# EAGLE board spartan6lx_board (EAGLE 5.11)
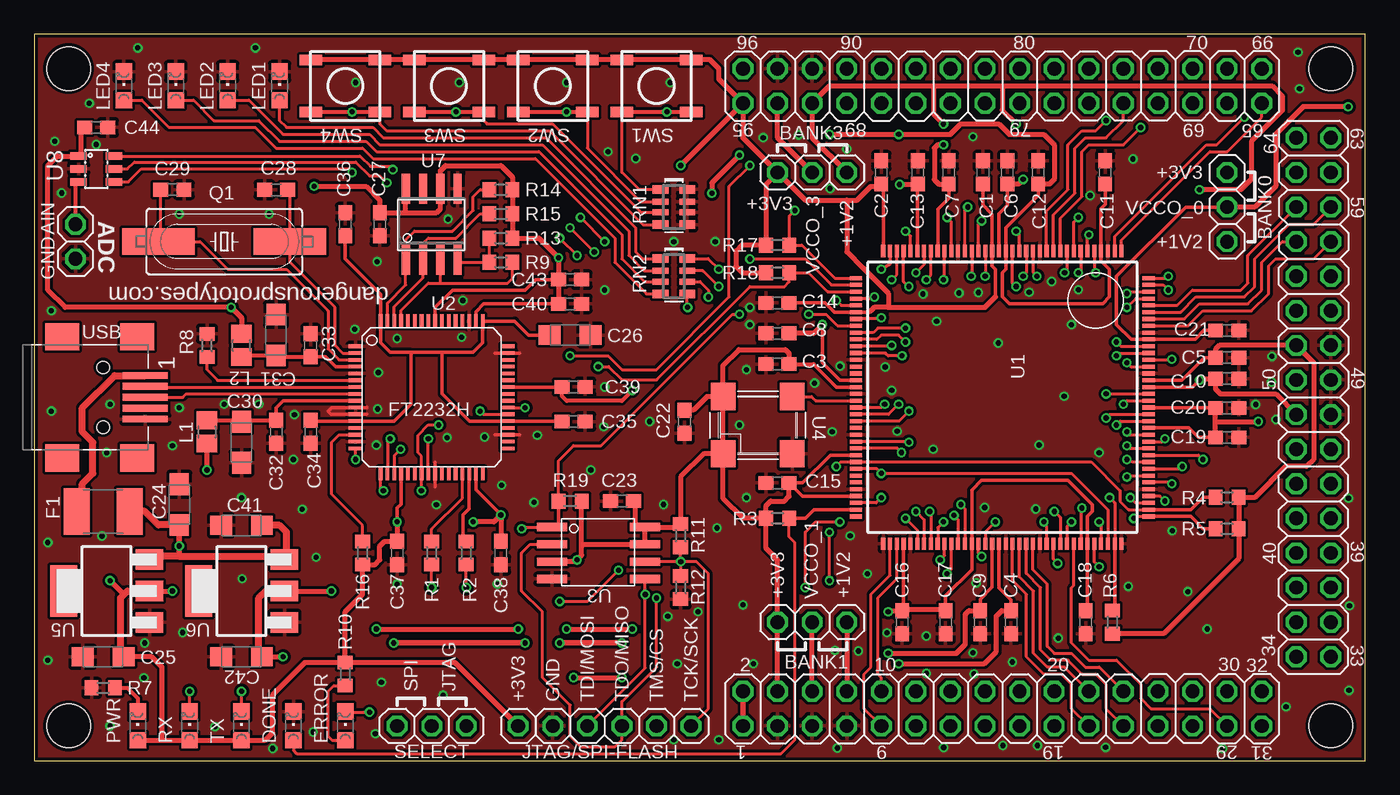
[diagram p2: board, top side]
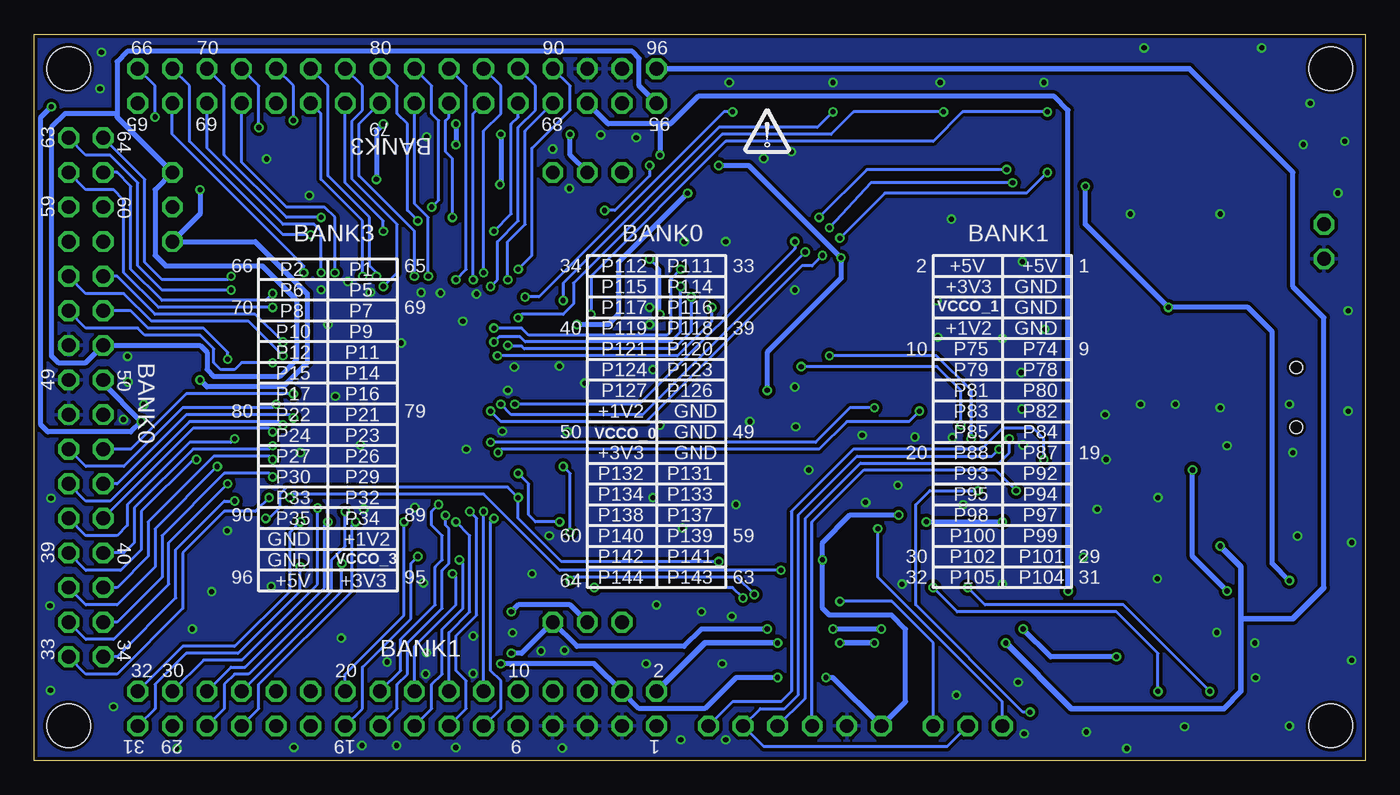
[diagram p3: board, bottom side, seen from below]

Size 97.79 x 53.34 mm. Coordinates in mm from the lower left corner, seen from the top.
Outline: 0,0 97.79,0 97.79,53.34 0,53.34 0,0
Copper layers (1*16): Top 0.035mm / dielectric 1.5mm / Bottom 0.035mm
Design rules "Fusion_eagle_rule_v1.1": minimum track width 6mil, minimum drill 12mil, track to track 6mil, track to pad 6mil, pad to pad 6mil, via to via 6mil, smd to smd 0mil, copper to edge 10mil, drill to drill 10mil, minimum pad ring 10mil, minimum via ring 6mil, stop-mask expansion 2mil, vias tented up to drill 100mil, thermal gap 10mil
Holes 3.2 mm at 2.54,2.54 2.54,50.8 95.25,50.8 95.25,2.54

## Footprints (pad centres in the part's own frame; a part is rotated, then mirrored left to right if it is on the bottom)
1X02 = drill 1.016 octagon: 1 -1.27,0; 2 1.27,0
2X16 = drill 1.016 octagon: 1 -19.05,-1.27; 2 -19.05,1.27; 3 -16.51,-1.27; 4 -16.51,1.27; 5 -13.97,-1.27; 6 -13.97,1.27; 7 -11.43,-1.27; 8 -11.43,1.27; 9 -8.89,-1.27; 10 -8.89,1.27; 11 -6.35,-1.27; 12 -6.35,1.27; 13 -3.81,-1.27; 14 -3.81,1.27; 15 -1.27,-1.27; 16 -1.27,1.27; 17 1.27,-1.27; 18 1.27,1.27; 19 3.81,-1.27; 20 3.81,1.27; 21 6.35,-1.27; 22 6.35,1.27; 23 8.89,-1.27; 24 8.89,1.27; 25 11.43,-1.27; 26 11.43,1.27; 27 13.97,-1.27; 28 13.97,1.27; 29 16.51,-1.27; 30 16.51,1.27; 31 19.05,-1.27; 32 19.05,1.27
C603 = smd 1.1 x 1: 1 -0.85,0; 2 0.85,0
SMC_A = smd 1.6 x 1.4: + -1.5,0; - 1.5,0
LED-805 = smd 1.2 x 1.2: A 0,-1.05; C 0,1.05
L1812 = smd 1.9 x 3.4: 1 -1.95,0; 2 1.95,0
1X06 = drill 1.016 octagon: 1 -6.35,0; 2 -3.81,0; 3 -1.27,0; 4 1.27,0; 5 3.81,0; 6 6.35,0
FB805 = smd 1.3 x 1.5: 1 -0.85,0; 2 0.85,0
HC-49U = smd 5.334 x 1.93: 1 -4.826,0; 2 4.826,0
R603 = smd 1 x 1.1: 1 -0.85,0; 2 0.85,0
RN8P-4R-CRA06S = smd 0.63 x 1.15: 1 -1.295,-0.975; 4 1.295,-0.975; 5 1.295,0.975; 8 -1.295,0.975 | smd 0.44 x 1.15: 2 -0.4,-0.975; 3 0.4,-0.975; 6 0.4,0.975; 7 -0.4,0.975
1X03 = drill 1.016 octagon: 1 -2.54,0; 2 0,0; 3 2.54,0
TACT_SWITCH_SMALL = smd 1.651 x 0.762: 1 -2.54,1.905; 2 2.54,1.905; 3 -2.54,-1.905; 4 2.54,-1.905
TQFP144 = smd 0.9 x 0.3: 1 -10.75,8.75; 2 -10.75,8.25; 3 -10.75,7.75; 4 -10.75,7.25; 5 -10.75,6.75; 6 -10.75,6.25; 7 -10.75,5.75; 8 -10.75,5.25; 9 -10.75,4.75; 10 -10.75,4.25; 11 -10.75,3.75; 12 -10.75,3.25; 13 -10.75,2.75; 14 -10.75,2.25; 15 -10.75,1.75; 16 -10.75,1.25; 17 -10.75,0.75; 18 -10.75,0.25; 19 -10.75,-0.25; 20 -10.75,-0.75; 21 -10.75,-1.25; 22 -10.75,-1.75; 23 -10.75,-2.25; 24 -10.75,-2.75; 25 -10.75,-3.25; 26 -10.75,-3.75; 27 -10.75,-4.25; 28 -10.75,-4.75; 29 -10.75,-5.25; 30 -10.75,-5.75; 31 -10.75,-6.25; 32 -10.75,-6.75; 33 -10.75,-7.25; 34 -10.75,-7.75; 35 -10.75,-8.25; 36 -10.75,-8.75; 73 10.75,-8.75; 74 10.75,-8.25; 75 10.75,-7.75; 76 10.75,-7.25; 77 10.75,-6.75; 78 10.75,-6.25; 79 10.75,-5.75; 80 10.75,-5.25; 81 10.75,-4.75; 82 10.75,-4.25; 83 10.75,-3.75; 84 10.75,-3.25; 85 10.75,-2.75; 86 10.75,-2.25; 87 10.75,-1.75; 88 10.75,-1.25; 89 10.75,-0.75; 90 10.75,-0.25; 91 10.75,0.25; 92 10.75,0.75; 93 10.75,1.25; 94 10.75,1.75; 95 10.75,2.25; 96 10.75,2.75; 97 10.75,3.25; 98 10.75,3.75; 99 10.75,4.25; 100 10.75,4.75; 101 10.75,5.25; 102 10.75,5.75; 103 10.75,6.25; 104 10.75,6.75; 105 10.75,7.25; 106 10.75,7.75; 107 10.75,8.25; 108 10.75,8.75 | smd 0.3 x 0.9: 37 -8.75,-10.75; 38 -8.25,-10.75; 39 -7.75,-10.75; 40 -7.25,-10.75; 41 -6.75,-10.75; 42 -6.25,-10.75; 43 -5.75,-10.75; 44 -5.25,-10.75; 45 -4.75,-10.75; 46 -4.25,-10.75; 47 -3.75,-10.75; 48 -3.25,-10.75; 49 -2.75,-10.75; 50 -2.25,-10.75; 51 -1.75,-10.75; 52 -1.25,-10.75; 53 -0.75,-10.75; 54 -0.25,-10.75; 55 0.25,-10.75; 56 0.75,-10.75; 57 1.25,-10.75; 58 1.75,-10.75; 59 2.25,-10.75; 60 2.75,-10.75; 61 3.25,-10.75; 62 3.75,-10.75; 63 4.25,-10.75; 64 4.75,-10.75; 65 5.25,-10.75; 66 5.75,-10.75; 67 6.25,-10.75; 68 6.75,-10.75; 69 7.25,-10.75; 70 7.75,-10.75; 71 8.25,-10.75; 72 8.75,-10.75; 109 8.75,10.75; 110 8.25,10.75; 111 7.75,10.75; 112 7.25,10.75; 113 6.75,10.75; 114 6.25,10.75; 115 5.75,10.75; 116 5.25,10.75; 117 4.75,10.75; 118 4.25,10.75; 119 3.75,10.75; 120 3.25,10.75; 121 2.75,10.75; 122 2.25,10.75; 123 1.75,10.75; 124 1.25,10.75; 125 0.75,10.75; 126 0.25,10.75; 127 -0.25,10.75; 128 -0.75,10.75; 129 -1.25,10.75; 130 -1.75,10.75; 131 -2.25,10.75; 132 -2.75,10.75; 133 -3.25,10.75; 134 -3.75,10.75; 135 -4.25,10.75; 136 -4.75,10.75; 137 -5.25,10.75; 138 -5.75,10.75; 139 -6.25,10.75; 140 -6.75,10.75; 141 -7.25,10.75; 142 -7.75,10.75; 143 -8.25,10.75; 144 -8.75,10.75
LQFP64 = smd 1 x 0.27: 1 -5.6,3.75; 2 -5.6,3.25; 3 -5.6,2.75; 4 -5.6,2.25; 5 -5.6,1.75; 6 -5.6,1.25; 7 -5.6,0.75; 8 -5.6,0.25; 9 -5.6,-0.25; 10 -5.6,-0.75; 11 -5.6,-1.25; 12 -5.6,-1.75; 13 -5.6,-2.25; 14 -5.6,-2.75; 15 -5.6,-3.25; 16 -5.6,-3.75; 33 5.6,-3.75; 34 5.6,-3.25; 35 5.6,-2.75; 36 5.6,-2.25; 37 5.6,-1.75; 38 5.6,-1.25; 39 5.6,-0.75; 40 5.6,-0.25; 41 5.6,0.25; 42 5.6,0.75; 43 5.6,1.25; 44 5.6,1.75; 45 5.6,2.25; 46 5.6,2.75; 47 5.6,3.25; 48 5.6,3.75 | smd 0.27 x 1: 17 -3.75,-5.6; 18 -3.25,-5.6; 19 -2.75,-5.6; 20 -2.25,-5.6; 21 -1.75,-5.6; 22 -1.25,-5.6; 23 -0.75,-5.6; 24 -0.25,-5.6; 25 0.25,-5.6; 26 0.75,-5.6; 27 1.25,-5.6; 28 1.75,-5.6; 29 2.25,-5.6; 30 2.75,-5.6; 31 3.25,-5.6; 32 3.75,-5.6; 49 3.75,5.6; 50 3.25,5.6; 51 2.75,5.6; 52 2.25,5.6; 53 1.75,5.6; 54 1.25,5.6; 55 0.75,5.6; 56 0.25,5.6; 57 -0.25,5.6; 58 -0.75,5.6; 59 -1.25,5.6; 60 -1.75,5.6; 61 -2.25,5.6; 62 -2.75,5.6; 63 -3.25,5.6; 64 -3.75,5.6
SOIC8W = smd 0.6 x 2.2: 1 -1.905,-3.87; 2 -0.635,-3.87; 3 0.635,-3.87; 4 1.905,-3.87; 5 1.905,2.981; 6 0.635,2.981; 7 -0.635,2.981; 8 -1.905,2.981
OSCILLATOR_7X5_SMD = smd 1.8 x 2: 1 -2.54,-2.1; 2 2.54,-2.1; 3 2.54,2.1; 4 -2.54,2.1
SOT223 = smd 1.5 x 2: 1 -2.3,-3.15; 2 0,-3.15; 3 2.3,-3.15 | smd 3.8 x 2: 4 0,3.15
SOIC8 = smd 0.6 x 2.2: 1 -1.905,-2.6; 2 -0.635,-2.6; 3 0.635,-2.6; 4 1.905,-2.6; 5 1.905,2.6; 6 0.635,2.6; 7 -0.635,2.6; 8 -1.905,2.6
SOT23-6 = smd 0.55 x 1.2: 1 -0.95,-1.3; 2 0,-1.3; 3 0.95,-1.3; 4 0.95,1.3; 5 0,1.3; 6 -0.95,1.3
CONN_USB_MINI-B = smd 2 x 2.5: BODY@1 -4.45,2.5; BODY@2 4.45,2.5; BODY@3 4.45,-3; BODY@4 -4.45,-3 | smd 0.5 x 3.3: D+ 0,3.1; D- -0.8,3.1; GND 1.6,3.1; ID 0.8,3.1; VUSB -1.6,3.1 | hole 0.9: -2.2,0; 2.2,0

## Placement (x,y rotation side)
ADC  [1X02]  3.05,38.1 270 top
BANK0  [2X16]  93.98,26.67 90 top
BANK1  [2X16]  71.12,3.81 0 top
BANK3  [2X16]  71.12,49.53 0 top
C1  0.1uF  [C603]  69.7,43.18 90 top
C2  0.1uF  [C603]  62.23,43.18 90 top
C3  0.1uF  [C603]  54.61,29.11 180 top
C4  0.1uF  [C603]  71.76,10.16 270 top
C5  0.1uF  [C603]  87.63,29.57 0 top
C6  0.1uF  [C603]  71.49,43.18 90 top
C7  0.1uF  [C603]  67.18,43.18 90 top
C8  0.1uF  [C603]  54.61,31.37 180 top
C9  0.1uF  [C603]  69.5,10.16 270 top
C10  0.1uF  [C603]  87.63,28.03 0 top
C11  0.1uF  [C603]  78.68,43.18 90 top
C12  0.1uF  [C603]  73.75,43.18 90 top
C13  0.1uF  [C603]  64.92,43.18 90 top
C14  0.1uF  [C603]  54.61,33.6 180 top
C15  0.1uF  [C603]  54.61,20.38 180 top
C16  0.1uF  [C603]  63.76,10.16 270 top
C17  0.1uF  [C603]  66.95,10.16 270 top
C18  0.1uF  [C603]  77.24,10.16 270 top
C19  0.1uF  [C603]  87.63,23.72 0 top
C20  0.1uF  [C603]  87.63,25.88 0 top
C21  0.1uF  [C603]  87.63,31.58 0 top
C22  0.1uF  [C603]  47.77,24.87 270 top
C23  0.1uF  [C603]  43.18,19.05 180 top
C24  4.7uF  [SMC_A]  10.67,18.8 90 top
C25  4.7uF  [SMC_A]  5.08,7.62 180 top
C26  3.3uF  [SMC_A]  39.37,31.24 0 top
C27  0.1uF  [C603]  25.4,39.37 270 top
C28  27pF  [C603]  17.78,41.91 180 top
C29  27pF  [C603]  10.16,41.91 0 top
C30  4.7uF  [SMC_A]  15.24,23.37 270 top
C31  4.7uF  [SMC_A]  17.78,31.24 90 top
C32  0.1uF  [C603]  17.78,24.13 270 top
C33  0.1uF  [C603]  20.32,30.48 90 top
C34  0.1uF  [C603]  20.32,24.13 270 top
C35  0.1uF  [C603]  39.62,24.89 0 top
C36  0.1uF  [C603]  22.86,39.37 90 top
C37  0.1uF  [C603]  26.67,15.24 270 top
C38  0.1uF  [C603]  34.29,15.24 270 top
C39  0.1uF  [C603]  39.62,27.43 0 top
C40  0.1uF  [C603]  39.37,33.53 0 top
C41  4.7uF  [SMC_A]  15.24,17.27 180 top
C42  4.7uF  [SMC_A]  15.24,7.62 180 top
C43  0.1uF  [C603]  39.37,35.31 0 top
C44  0.1uF  [C603]  4.57,46.48 0 top
DONE  [LED-805]  19.05,2.54 0 top
ERROR  [LED-805]  22.86,2.54 0 top
F1  500mA  [L1812]  5.08,18.29 180 top
JTAG/SPI-FLASH  [1X06]  41.91,2.54 0 top
L1  [FB805]  12.7,24.13 270 top
L2  [FB805]  15.24,30.48 90 top
LED1  [LED-805]  18.03,49.53 0 top
LED2  [LED-805]  14.22,49.53 0 top
LED3  [LED-805]  10.41,49.53 0 top
LED4  [LED-805]  6.6,49.53 0 top
PWR  [LED-805]  7.62,2.54 0 top
Q1  [HC-49U]  13.97,38.1 180 top
R1  470  [R603]  29.21,15.24 270 top
R2  470  [R603]  31.75,15.24 270 top
R3  330  [R603]  54.61,17.8 180 top
R4  4.7k  [R603]  87.63,19.32 0 top
R5  4.7k  [R603]  87.63,17.02 0 top
R6  4.7k  [R603]  79.2,10.16 270 top
R7  470  [R603]  5.08,5.33 0 top
R8  12k 1%  [R603]  12.7,30.48 270 top
R9  2.2k  [R603]  34.29,36.58 0 top
R10  330  [R603]  22.86,6.35 270 top
R11  100R  [R603]  47.5,16.51 90 top
R12  100R  [R603]  47.5,12.7 90 top
R13  10k  [R603]  34.29,38.35 0 top
R14  10k  [R603]  34.29,41.91 0 top
R15  10k  [R603]  34.29,40.13 0 top
R16  10k  [R603]  24.13,15.24 90 top
R17  4.7k  [R603]  54.61,37.85 0 top
R18  4.7k  [R603]  54.61,35.81 0 top
R19  4.7k  [R603]  39.37,19.05 0 top
RN1  4.7k  [RN8P-4R-CRA06S]  46.99,40.64 270 top
RN2  330  [RN8P-4R-CRA06S]  46.99,35.56 270 top
RX  [LED-805]  11.43,2.54 0 top
SELECT  [1X03]  29.21,2.54 180 top
SW1  [TACT_SWITCH_SMALL]  45.72,49.53 180 top
SW2  [TACT_SWITCH_SMALL]  38.1,49.53 180 top
SW3  [TACT_SWITCH_SMALL]  30.48,49.53 180 top
SW4  [TACT_SWITCH_SMALL]  22.86,49.53 180 top
TX  [LED-805]  15.24,2.54 0 top
U1  XC6SLX93TQG144C  [TQFP144]  71.12,26.67 270 top
U2  FT2232H  [LQFP64]  29.21,26.67 0 top
U3  W25X10  [SOIC8W]  41.91,15.24 270 top
U4  OSC-OSCILLATOR  [OSCILLATOR_7X5_SMD]  53.16,24.62 0 top
U5  [SOT223]  5.33,12.45 90 top
U6  [SOT223]  15.24,12.45 90 top
U7  93C46  [SOIC8]  29.21,39.37 0 top
U8  MAX111*-ADC  [SOT23-6]  4.57,43.43 270 top
U$1  DP_LOGO  [DP_LOGO]  43.94,45.21 0 bottom
USB  CON-USB-MINI-BUSB1  [CONN_USB_MINI-B]  5.08,26.67 270 top
VCCO_0  [1X03]  87.63,40.64 270 top
VCCO_1  [1X03]  57.15,10.16 0 top
VCCO_3  [1X03]  57.15,43.18 0 top

## Tracks (layer width: path | path; a pad name or v marks a point on that pad's centre or on a via)
12MHZ
  Top 0.203: U1.55 57.4,26.42 57.1,26.72 U4.3
!RESET
  Top 0.203: U2.14 22.4,23.92 21.84,23.37 21.84,19.56 24.13,17.27 R16.2
+1V2  (via drill 0.38)
  Top 0.254: U1.89 70.37,12.71 69.5,11.85 C9.1 | U1.128 85.08,27.42 v85.6,27.94 | C6.1 71.49,40.76 70.87,40.14 U1.19 | C7.1 67.18,41.27 66.37,40.46 U1.28 | U1.52 59.2,27.92 57.91,29.21 v57.91,32
  Top 0.381: VCCO_1.3 BANK1.8 | C42.+ v18.29,7.62 | v25.15,9.65 v35.56,9.65 | v39.12,9.65 v43.94,9.65 | v62.74,7.87 67.75,7.87 68.39,8.52 68.39,10.74 68.67,11.01 C9.1 | U6.2 v21.84,12.45 | v49.78,41.66 49.78,42.42 v51.82,44.45 | C8.1 57.28,31.37 v57.91,32 | VCCO_3.3 57.15,45.72 BANK3.5 58.42,49.53 66.04,49.53 | v66.8,46.74 66.04,47.5 66.04,49.53 | C7.1 66.45,42.33 66.13,42.65 66.13,44.97 66.38,45.21 v66.8,45.21 | 66.04,49.53 71.12,49.53 | v72.14,46.74 71.12,47.75 71.12,49.53 | C6.1 72.3,42.33 v72.64,42.67 | 71.12,49.53 90.93,49.53 91.69,48.77 91.69,47.75 89.41,45.47 89.41,42.67 88.65,41.91 v85.6,41.91 | v85.6,27.94 85.69,28.03 C10.1 86.78,27.29 87.14,26.92 91.19,26.92 BANK0.16
  Top 0.508: U6.2 17.02,12.45 16.51,11.94 16.51,7.85 C42.+
  Bottom 0.381: v18.29,7.62 23.11,7.62 v25.15,9.65 | v35.56,9.65 v39.12,9.65 | v43.94,9.65 48.77,9.65 50.04,8.38 57.91,8.38 VCCO_1.3 61.98,7.87 v62.74,7.87 | v21.84,12.45 21.84,47.75 22.86,48.77 49.02,48.77 51.05,46.74 51.82,46.74 | BANK3.5 55.63,46.74 51.82,46.74 | 51.82,46.74 v51.82,44.45 | v57.91,32 55.63,32 54.86,32.77 54.86,36.58 v49.78,41.66 | v66.8,46.74 v66.8,45.21 | v72.64,42.67 72.64,46.23 v72.14,46.74 | v85.6,41.91 85.6,40.13 VCCO_0.3 81.53,38.1 77.72,34.29 77.72,29.21 79.5,27.43 85.09,27.43 v85.6,27.94
+1V8
  Top 0.254: C34.1 20.38,24.92 U2.12 26.44,24.92 27.69,26.16 27.69,29.97 | C26.+ 36.32,31.24 35.29,32.27 U2.49 32.96,30.67 32.26,29.97 29.97,29.97 | C36.1 22.86,36.83 25.46,34.23 U2.64 25.46,30.67 26.16,29.97 27.69,29.97 | C35.1 38.75,24.92 U2.37 31.98,24.92 29.97,26.92 29.97,29.97 | 27.69,29.97 29.97,29.97
+3V3  (via drill 0.38)
  Top 0.254: U1.90 70.87,12.7 71.76,11.8 C4.1 | U1.129 84.31,27.92 85.96,29.57 C5.1 | C1.1 69.7,40.79 70.37,40.12 U1.20 70.37,36.31 70.61,36.07 70.61,34.04 | C2.1 62.37,42.19 U1.36 | U1.53 58.94,27.42 57.25,29.11 | U1.63 58.49,22.42 56.45,20.38 C15.1 56.42,19.42 U1.69 | U2.42 C39.1 | U2.56 29.46,33.27 30.73,34.54 36.07,34.54 36.83,35.31 C43.1 | C40.1 33.02,33.53 32.46,32.97 U2.50 | U2.31 32.46,19.86 v34.29,18.03 | U2.20 26.96,18.83 26.67,18.54 v26.67,17.53 | C14.1 58.09,33.6 58.77,32.92 U1.42 61.37,32.92 61.47,33.02
  Top 0.305: 44.2,19.05 C23.1 | 44.2,17.27 44.32,17.14 U3.8 | R3.2 53.74,17.78 | 62.23,42.16 C2.1 | v43.94,27.18 43.18,26.42 39.12,26.42 38.77,26.76 C39.1 | C3.1 57.25,29.11
  Top 0.381: v20.57,42.16 24.38,42.16 25.4,41.15 C27.1 27.31,40.22 | C44.1 3.48,46.24 3.48,44.42 3.44,44.38 U8.1 1.71,44.38 1.02,43.69 1.02,34.54 2.29,33.27 v14.48,33.27 15.24,32.51 L2.2 | 27.31,40.22 29.55,40.22 29.84,40.51 U7.6 29.84,43.31 30.23,43.69 34.29,43.69 35.14,42.84 R14.2 R15.2 R13.2 37.08,38.35 v38.52,36.92 C43.1 C40.1 | U7.8 27.3,40.22 27.31,40.22 | v5.59,13.21 6.48,12.32 6.73,12.32 | v12.7,21.34 L1.2 | PWR.A 9.4,1.49 | 9.4,1.49 RX.A TX.A 16.98,1.49 17.53,2.03 17.53,4.83 19.9,7.2 R10.1 | C25.+ 8.64,7.62 9.4,6.86 9.4,1.49 | U5.2 v10.16,12.45 | R10.1 30.9,7.2 JTAG/SPI-FLASH.1 | R10.1 22.86,10.92 24.13,12.19 R16.1 25.06,14.39 25.4,14.73 25.4,15.75 25.74,16.09 C37.1 | v26.67,17.53 26.67,16 | v32.26,17.53 33.78,17.53 v34.29,18.03 C38.1 | 40.22,15.75 40.22,15.07 v39.88,14.73 39.75,14.61 U3.3 | 40.22,15.75 R19.2 | 44.2,17.27 44.2,19.05 | 40.22,15.75 40.35,15.88 U3.7 U3.8 47.28,17.14 R11.2 | U4.1 49.19,22.52 47.5,20.83 47.5,17.27 | 53.74,17.78 52.07,17.78 50.62,19.23 U4.1 | C15.1 55.46,19.39 55.12,19.05 54.1,19.05 53.76,18.71 R3.2 53.76,15.58 54.61,14.73 VCCO_1.1 BANK1.4 | v39.62,6.1 v43.18,6.1 | v63.5,7.11 69.79,7.11 70.68,8 70.68,10.61 71.08,11.01 C4.1 | U4.1 U4.4 | U4.4 49.41,26.72 48.42,25.72 C22.1 | C3.1 55.46,29.9 55.18,30.17 51.76,30.17 50.62,29.03 U4.4 | v47.5,43.69 BANK3.1 | BANK3.1 52.07,45.72 VCCO_3.1 | VCCO_3.1 53.76,42.33 R17.1 51.98,37.85 51.54,37.41 51.54,36.29 52.02,35.81 R18.1 | 62.23,42.16 61.47,42.16 60.45,41.15 59.69,41.15 | 59.69,41.15 56.64,41.15 VCCO_3.1 | SW4.4 SW4.3 SW3.4 SW3.3 SW2.4 SW2.3 SW1.4 SW1.3 49.66,51.44 50.29,50.8 50.29,50.04 BANK3.1 | 88.5,19.3 89.66,19.3 91.95,21.59 93.47,21.59 93.98,22.1 93.98,29.21 BANK0.20 87.07,30.48 86.78,30.19 C5.1
  Top 0.381: 88.5,19.3 R4.2 | 88.5,19.3 88.5,17.04 R5.2 88.48,14.82 82.97,9.31 R6.2 | 62.74,33.27 62.74,34.31 60.87,36.17 60.85,36.17 59.69,37.34 59.69,41.15 | 62.74,33.27 69.85,33.27 70.61,34.04 | 62.74,33.27 61.72,33.27 61.47,33.02
  Top 0.508: U5.2 6.86,12.45 6.73,12.32 6.35,11.94 6.35,7.85 C25.+
  Bottom 0.381: v20.57,42.16 20.57,39.37 v14.48,33.27 8.64,33.27 6.86,31.5 6.86,14.48 v5.59,13.21 | v47.5,43.69 45.29,43.69 v38.52,36.92 38.52,35.39 43.94,29.97 v43.94,27.18 | v12.7,21.34 12.7,14.99 v10.16,12.45 | v32.26,17.53 v26.67,17.53 | v34.29,18.03 37.85,18.03 39.88,16 v39.88,14.73 39.88,11.18 39.37,10.67 34.8,10.67 33.78,9.65 33.78,4.32 JTAG/SPI-FLASH.1 39.12,6.1 v39.62,6.1 | v43.18,6.1 46.23,6.1 48.51,3.81 53.34,3.81 BANK1.4 56.64,7.11 v63.5,7.11 | BANK3.1 53.34,49.53 53.34,51.56 53.85,52.07 90.93,52.07 91.69,51.31 91.69,47.5 | 91.69,47.5 91.69,47.24 VCCO_0.1 88.9,41.91 88.9,37.08 88.14,36.32 81.03,36.32 78.49,33.78 78.49,29.46 79.76,28.19 84.58,28.19 85.09,28.7 85.09,29.97 85.6,30.48 BANK0.20 93.98,29.21 96.01,29.21 96.52,29.72 96.52,46.48 95.5,47.5 91.69,47.5
+5V  (via drill 0.38)
  Top 0.406: BANK1.2 BANK1.1 | 10.67,14.99 v10.67,15.75 C24.+ | v26.42,8.64 v36.07,8.64 | v38.61,8.64 v43.18,8.64
  Top 0.508: F1.1 8.13,18.29 9.12,17.3 C24.+ | U5.3 8.48,14.83 8.64,14.99 10.67,14.99 18.15,14.99 U6.3 18.54,14.9 18.54,16.76 18.03,17.27 C41.+
  Bottom 0.381: 3.05,12.7 3.05,32.51 5.33,34.8 5.33,43.18 12.95,50.8
  Bottom 0.406: v10.67,15.75 9.14,14.22 9.14,10.41 | 9.14,10.41 9.14,5.08 10.41,3.81 21.59,3.81 v26.42,8.64 | v36.07,8.64 v38.61,8.64 | v43.18,8.64 48.51,8.64 BANK1.2 | 12.95,50.8 BANK3.2 | 3.05,12.7 5.33,10.41 9.14,10.41
AC3
  Top 0.203: U2.29 31.46,19.27 29.21,17.02 R1.1
AC4
  Top 0.254: U2.30 31.96,18.5 31.5,18.03 31.5,16.34 R2.1
CSO_B  (via drill 0.38)
  Top 0.203: v35.81,17.02 35.94,17.14 U3.1 | U1.38 58.55,34.92 56.64,36.83 v52.58,36.83 | R19.1 38.52,22.01 39.62,23.11 41.66,23.11 51.31,32.77 v51.82,32.77
  Top 0.254: U3.1 38.23,17.14 38.35,17.27 38.52,17.27 R19.1
  Bottom 0.203: v51.82,32.77 51.82,36.07 v52.58,36.83 | v35.81,17.02 35.81,13.46 26.67,4.32 SELECT.3
DM
  Top 0.203: U2.7 8.23,27.42 USB.D-
DONE
  Top 0.203: DONE.A 19.05,0.76 19.3,0.51 54.86,0.51 55.88,1.52 55.88,16 55.46,16.42 R3.1
  Top 0.254: R3.1 56.66,17.8 57.28,18.42 U1.71
DP
  Top 0.203: U2.8 11.17,26.92 10.92,26.67 USB.D+
EECLK
  Top 0.203: U2.62 26.46,33.32 28.57,35.43 U7.2 28.57,37.97 28.96,38.35 30.99,38.35 32.77,40.13 R15.1
EECS
  Top 0.203: U2.63 25.96,33.58 27.3,34.92 U7.1 27.3,38.23 27.94,38.86 30.73,38.86 32.26,40.39 32.26,41.4 32.77,41.91 R14.1
EEDATA
  Top 0.203: U2.61 26.96,33.06 28.96,35.05 29.84,35.05 | R9.2 35.14,35.39 34.8,35.05 29.84,35.05 | 29.84,35.05 U7.3
GND  (via drill 0.38)
  Top 0.254: U2.11 21.82,25.42 21.59,25.65 21.86,25.92 U2.10 | 22.65,25.92 24.44,25.92 24.45,25.93 | 22.63,25.42 24.42,25.42 | 33.87,29.92 35.66,29.92 | 33.86,23.92 35.65,23.92 | 29.46,20.12 29.46,21.91
  other vias: 10.16,23.11 13.97,26.16 16.51,26.16 10.67,25.91 5.59,26.16 5.33,22.61 31.5,33.78 41.91,34.54 26.67,30.99 51.82,24.64 66.04,22.86 76.2,32 66.29,32.26 78.23,22.61 41.85,24.51 36.96,23.88 29.55,18.78 34.33,20.21 36.72,18.96 33.09,23.75 40.89,21.34 46.23,18.8 45.21,24.89 52.32,19.3 62.99,27.18 52.58,33.27 41.91,27.43 52.58,32 46.99,38.1 50.04,38.1 44.2,44.2 42.16,44.7 46.74,49.78 39.12,49.78 31.24,49.78 23.62,49.78 4.06,48.26 7.62,52.32 16.26,52.32 1.52,45.47 1.27,33.02 10.67,40.13 17.27,40.13 1.27,25.65 1.02,16 1.02,7.37 5.59,2.54 10.92,9.4 8.13,8.64 15.24,19.3 19.05,22.1 26.67,12.95 34.04,12.95 46.55,10.59 47.24,7.11 46.99,1.52 50.29,1.52 52.83,7.11 52.07,11.43 48.77,10.92 61.21,13.72 59.94,16.51 65.53,9.14 62.65,9.38 69.2,13.05 69.82,18.58 73.58,18.47 74.74,35.17 76.7,34.56 73.08,34.38 69.36,34.36 65.29,34.26 67.94,34.33 75.23,8.99 71.86,7.24 71.16,1.11 73.7,1.11 68.96,7.92 58.82,8.09 60.55,8.04 69.04,6.36 65.55,6.39 90.92,29.68 90.89,27.8 91.23,25.04 80.71,44.16 77.57,41.48 89.73,26.14 68.95,45.8 59.7,44.91 58.47,41.99 56.16,45.94 53.56,45.73 92.84,52.01 92.95,49.33 96.54,19.26 96.62,11.37 96.58,5.15 80.37,12.79 83.6,16.87 86.17,9.65 91.95,3.95 84.74,12.4 78.71,0.97 87.31,0.88 66.82,0.96 59,0.92 25.08,1.97 30.04,4.8 25.5,5.75 20.5,2.09 17.53,0.88 13.29,2.49 15.29,13.34 20.72,14.92 8.08,6.07 70.82,30.66 73.82,23.16 75.66,26.75 50.17,17.08 4.99,16.49 19.7,18.45 19.12,25.39 30.34,23.71 25.3,28.49 25.23,25.81 25.15,23.16 23.55,31.67 31.4,31.08 62.51,28.89 52.32,28.7 57.33,27.71 59.2,28.96 58.62,24.14 63.4,24.18 25.19,36.63 30.41,39.75 4.57,45.23 2.03,41.67
  pour Bottom (isolate 0.254): 0,0 97.79,0 97.79,53.34 0,53.34
  pour Top (isolate 0.203): 0,0 97.79,0 97.79,53.34 0,53.34
INIT_B  (via drill 0.38)
  Top 0.203: U1.39 58.29,34.42 56.9,35.81 R18.2 55.46,35.14 55.12,34.8 52.58,34.8 45.72,27.94 43.18,27.94 42.2,28.92 v41.44,28.92 | v24.64,3.56 22.89,3.56 ERROR.C | v28.45,19.81 28.46,19.82 U2.23 28.46,22.34 28.19,22.61 28.19,23.88 28.96,24.64 v29.72,24.64
  Bottom 0.203: v24.64,3.56 25.15,3.56 33.02,11.43 33.02,18.8 32,19.81 v28.45,19.81 | v41.44,28.92 31.46,28.92 29.72,27.18 v29.72,24.64
N$1
  Top 0.203: R10.2 22.01,5.5 21.59,5.08 21.59,1.78 21.88,1.49 ERROR.A
N$2
  Top 0.305: ADC.1 3.05,42.26 U8.3
N$4
  Top 0.203: RN2.1 44.68,36.85 44.2,37.34 44.2,39.12 37.59,45.72 25.65,45.72 24.89,46.48 18.54,46.48 18.03,46.99 LED1.A
N$5
  Top 0.203: RN2.4 44.98,34.27 42.67,36.58 42.67,38.35 36.83,44.2 24.89,44.2 24.13,44.96 17.78,44.96 16.26,46.48 9.91,46.48 7.91,48.48 LED4.A
N$6
  Top 0.203: RN2.3 44.85,35.16 43.18,36.83 43.18,38.61 37.08,44.7 25.15,44.7 24.38,45.47 18.03,45.47 16.51,46.99 13.21,46.99 11.72,48.48 LED3.A
N$7
  Top 0.203: RN2.2 44.81,35.96 43.69,37.08 43.69,38.86 37.34,45.21 25.4,45.21 24.64,45.97 18.29,45.97 15.78,48.48 LED2.A
N$12
  Top 0.203: U2.6 13.48,27.92 12.7,28.7 R8.2
N$13
  Top 0.203: U2.2 22.66,29.92 22.1,30.48 22.1,33.27 18.8,36.58 Q1.1 18.8,41.74 C28.1
N$14
  Top 0.203: U2.3 22.4,29.42 21.59,30.23 21.59,33.02 18.54,36.07 14.22,36.07 12.19,38.1 Q1.2 9.31,38.27 C29.1
N$15
  Top 0.305: R7.2 6.86,5.33 7.62,4.57 PWR.C
N$16  (via drill 0.38)
  Top 0.203: RX.C v11.43,5.08 | v29.21,12.7 R1.2
  Bottom 0.203: v11.43,5.08 17.78,11.43 27.94,11.43 v29.21,12.7
N$17  (via drill 0.38)
  Top 0.203: TX.C v15.24,5.08 | v31.75,12.7 R2.2
  Bottom 0.203: v15.24,5.08 15.24,7.87 18.29,10.92 29.97,10.92 v31.75,12.7
N$18
  Top 0.508: USB.VUSB 5.92,28.27 3.56,25.91 3.56,24.13 4.32,23.37 4.32,21.08 3.56,20.32 3.56,18.71 F1.2
N$45
  Top 0.203: U7.4 31.31,36.58 R9.1 R13.1
N$48
  Top 0.254: U2.4 22.13,28.92 21.42,29.63 C33.1
  Top 0.305: C33.1 17.89,29.63 C31.+ 15.35,29.74 L2.1
N$49
  Top 0.254: U2.9 18.29,26.42 17.78,25.91 C32.1
  Top 0.305: C32.1 15.35,24.98 C30.+ 15.13,24.98 L1.1
P1
  Top 0.203: U1.1 79.87,38.21 86.36,44.7 87.63,44.7 90.17,47.24 BANK3.31
P2  (via drill 0.38)
  Top 0.203: U1.2 79.37,38.48 86.11,45.21 86.87,45.21 v88.9,47.24
  Bottom 0.203: v88.9,47.24 88.9,49.53 BANK3.32
P5  (via drill 0.38)
  Top 0.203: U1.5 77.87,35.92 v77.98,35.81
  Bottom 0.203: v77.98,35.81 77.98,36.32 87.63,45.97 BANK3.29
P6  (via drill 0.38)
  Top 0.203: U1.6 77.37,38.51 v77.47,38.61
  Bottom 0.203: v77.47,38.61 79.5,38.61 86.36,45.47 86.36,49.53 BANK3.30
P7  (via drill 0.38)
  Top 0.203: U1.7 76.87,35.98 v76.71,35.81
  Bottom 0.203: v76.71,35.81 76.71,38.86 77.22,39.37 79.5,39.37 85.09,44.96 BANK3.27
P8  (via drill 0.38)
  Top 0.203: U1.8 76.37,39.54 v76.71,39.88
  Bottom 0.203: v76.71,39.88 79.25,39.88 83.82,44.45 83.82,49.53 BANK3.28
P9  (via drill 0.38)
  Top 0.203: U1.9 75.87,35.99 v75.69,35.81
  Bottom 0.203: v75.69,35.81 75.69,39.88 76.45,40.64 79.25,40.64 82.55,43.94 BANK3.25
P10  (via drill 0.38)
  Top 0.203: U1.10 75.37,39.81 76.96,41.4 76.96,44.7 77.47,45.21 80.01,45.21 v81.28,46.48
  Bottom 0.203: v81.28,46.48 81.28,49.53 BANK3.26
P11
  Top 0.203: U1.11 74.87,40.07 76.45,41.66 76.45,44.96 77.22,45.72 78.74,45.72 80.01,46.99 BANK3.23
P12  (via drill 0.38)
  Top 0.203: U1.12 74.37,40.33 75.95,41.91 75.95,45.21 76.96,46.23 77.98,46.23 v78.74,46.99
  Bottom 0.203: v78.74,46.99 78.74,49.53 BANK3.24
P14  (via drill 0.38)
  Top 0.203: U1.14 73.37,35.85 v73.66,35.56
  Bottom 0.203: v73.66,35.56 73.66,39.62 76.71,42.67 76.71,47.5 BANK3.21
P15  (via drill 0.38)
  Top 0.203: U1.15 72.87,35.79 v72.64,35.56
  Bottom 0.203: v72.64,35.56 72.64,35.81 73.15,36.32 73.15,39.88 76.2,42.93 76.2,49.53 BANK3.22
P16  (via drill 0.38)
  Top 0.203: U1.16 72.37,38.63 v72.14,38.86
  Bottom 0.203: BANK3.19 74.93,42.42 72.14,39.62 v72.14,38.86
P17  (via drill 0.38)
  Top 0.203: U1.17 71.87,35.04 v72.14,34.8
  Bottom 0.203: v72.14,34.8 71.12,35.81 71.12,39.37 74.42,42.67 74.42,46.99 73.66,47.75 73.66,49.53 BANK3.20
P21  (via drill 0.38)
  Top 0.203: U1.21 69.87,35.58 v69.85,35.56
  Bottom 0.203: v69.85,35.56 69.85,38.86 73.91,42.93 73.91,46.74 BANK3.17
P22  (via drill 0.38)
  Top 0.203: U1.22 69.37,39.4 v69.6,39.62
  Bottom 0.203: BANK3.18 71.12,49.53 71.12,47.5 70.36,46.74 70.36,40.39 v69.6,39.62
P23  (via drill 0.38)
  Top 0.203: U1.23 68.87,35.6 v68.83,35.56
  Bottom 0.203: v68.83,35.56 68.83,39.88 69.85,40.89 BANK3.15
P24  (via drill 0.38)
  Top 0.203: U1.24 68.37,40.43 v68.58,40.64
  Bottom 0.203: BANK3.16 68.58,49.53 68.58,47.5 68.07,46.99 68.07,41.15 v68.58,40.64
P26  (via drill 0.38)
  Top 0.203: U1.26 67.37,39.56 v67.06,39.88
  Bottom 0.203: BANK3.13 67.31,47.24 67.56,46.99 67.56,44.7 67.06,44.2 v67.06,39.88
P27  (via drill 0.38)
  Top 0.203: U1.27 66.87,35.37 v66.8,35.31
  Bottom 0.203: v66.8,35.31 66.04,36.07 66.04,49.53 BANK3.14
P29  (via drill 0.38)
  Top 0.203: U1.29 65.87,35.64 v65.53,35.31
  Bottom 0.203: v65.53,35.31 65.53,47.5 BANK3.11
P30  (via drill 0.38)
  Top 0.203: U1.30 65.37,36.41 v64.77,35.81
  Bottom 0.203: v64.77,35.81 64.77,46.23 63.5,47.5 63.5,49.53 BANK3.12
P32  (via drill 0.38)
  Top 0.203: U1.32 64.37,38.5 v64.01,38.86
  Bottom 0.203: BANK3.9 62.23,47.24 62.74,46.74 62.74,40.13 v64.01,38.86
P33  (via drill 0.38)
  Top 0.203: U1.33 63.87,35.17 v64.26,34.8
  Bottom 0.203: v64.26,34.8 63.75,35.31 63.75,38.1 62.23,39.62 62.23,46.48 60.96,47.75 60.96,49.53 BANK3.10
P34  (via drill 0.38)
  Top 0.203: U1.34 63.37,35.68 v62.99,35.31
  Bottom 0.203: v62.99,35.31 62.99,38.1 61.72,39.37 61.72,46.23 BANK3.7
P35  (via drill 0.38)
  Top 0.203: U1.35 62.87,36.45 v62.23,36.07
  Bottom 0.203: BANK3.8 58.42,49.53 58.42,47.75 61.21,44.96 61.21,37.08 v62.23,36.07
P40  (via drill 0.38)
  Top 0.203: RN1.1 44.42,41.94 43.18,43.18 SW1.2 | U1.40 61.61,33.92 v61.72,34.04
  Top 0.305: SW1.2 v46.48,47.62 SW1.1
  Bottom 0.203: v61.72,34.04 60.71,34.04 47.12,47.62 v46.48,47.62
P41  (via drill 0.38)
  Top 0.203: RN1.2 44.56,41.04 40.64,44.96 SW2.1 | U1.41 59.29,33.42 v58.93,33.78
  Top 0.305: SW2.2 v39.12,47.62 SW2.1
  Bottom 0.203: v58.93,33.78 58.93,35.05 47.5,46.48 40.26,46.48 v39.12,47.62
P43  (via drill 0.38)
  Top 0.203: RN1.3 44.6,40.24 38.1,46.74 33.27,46.74 33.02,46.99 SW3.1 | U1.43 62.14,32.42 v62.23,32.51
  Top 0.305: SW3.2 v30.99,47.62 SW3.1
  Bottom 0.203: v62.23,32.51 61.98,32.77 58.93,32.77 58.17,33.53 58.17,35.05 47.24,45.97 39.24,45.97 37.59,47.62 v30.99,47.62
P44  (via drill 0.38)
  Top 0.203: SW4.1 25.4,46.74 25.91,46.23 37.85,46.23 44.73,39.34 RN1.4 45.97,39.3 | U1.44 59.01,31.92 58.17,32.77 v56.9,32.77
  Top 0.305: SW4.2 v23.37,47.62 SW4.1
  Bottom 0.203: v23.37,47.62 29.59,47.62 31.75,45.47 46.99,45.47 56.9,35.56 v56.9,32.77
P45  (via drill 0.38)
  Top 0.203: RN2.8 49.51,36.85 v50.29,36.07 | v64.01,31.75 61.98,31.75 61.65,31.42 U1.45
  Bottom 0.203: v50.29,36.07 51.05,35.31 51.05,31.5 51.31,31.24 61.47,31.24 61.98,31.75 v64.01,31.75
P46  (via drill 0.38)
  Top 0.203: RN2.7 49.13,35.96 v50.29,34.8 | v64.01,30.73 63.5,31.24 62.23,31.24 61.91,30.92 U1.46
  Bottom 0.203: v64.01,30.73 63.63,31.11 62.1,31.11 61.72,30.73 51.05,30.73 50.29,31.5 v50.29,34.8
P47  (via drill 0.38)
  Top 0.203: RN2.6 48.91,35.16 49.53,34.54 v49.53,34.04 | v62.99,30.48 62.93,30.42 U1.47
  Bottom 0.203: v62.99,30.48 62.93,30.42 61.98,30.42 61.78,30.23 50.8,30.23 49.53,31.5 v49.53,34.04
P48  (via drill 0.38)
  Top 0.203: RN2.5 47.97,33.31 v48.01,33.27 | U1.48 62.54,29.92 62.74,29.72 v63.75,29.72
  Bottom 0.203: v63.75,29.72 50.55,29.72 48.01,32.26 v48.01,33.27
P56  (via drill 0.38)
  Top 0.203: v26.36,43.38 26.09,43.62 24.7,43.62 23.94,44.38 U8.6 | v40.13,39.88 v41.91,38.1 | v62.48,26.16 62.24,25.92 U1.56
  Bottom 0.203: v26.36,43.38 36.63,43.38 v40.13,39.88 | v41.91,38.1 41.91,37.59 53.34,26.16 v62.48,26.16
P57  (via drill 0.38)
  Top 0.203: v25.91,42.42 25.4,42.93 24.64,42.93 23.62,43.94 7.37,43.94 6.86,43.43 U8.5 | v39.37,39.12 v41.15,37.34 | v63.5,26.16 62.76,25.42 U1.57
  Bottom 0.203: v25.91,42.42 36.32,42.42 v39.37,39.12 | v41.15,37.34 53.09,25.4 62.74,25.4 v63.5,26.16
P58  (via drill 0.38)
  Top 0.203: U8.4 6.92,42.48 7.87,43.43 23.11,43.43 v23.37,43.18 | v38.61,38.35 v39.88,37.08 | v64.26,25.65 63.53,24.92 U1.58
  Bottom 0.203: v23.37,43.18 24.89,41.66 35.31,41.66 v38.61,38.35 | v39.88,37.08 40.64,36.32 41.4,36.32 52.83,24.89 63.5,24.89 v64.26,25.65
P61  (via drill 0.38)
  Top 0.203: U2.39 36.06,25.92 v36.07,25.91 | v64.26,23.37 64.06,23.42 U1.61
  Bottom 0.203: v36.07,25.91 37.85,25.91 40.39,23.37 v64.26,23.37
P62  (via drill 0.38)
  Top 0.203: U2.38 33,25.42 v32.77,25.65 | U1.62 63.41,22.92 v63.7,22.62
  Bottom 0.203: v32.77,25.65 33.53,24.89 38.1,24.89 40.13,22.86 63.47,22.86 v63.7,22.62
P74
  Top 0.203: U1.74 62.87,13.59 61.47,12.19 61.47,6.86 60.96,6.35 60.96,3.81 BANK1.9
P75
  Top 0.203: U1.75 63.37,13.33 61.98,11.94 61.98,6.35 62.23,6.1 BANK1.10
P78  (via drill 0.38)
  Top 0.203: U1.78 64.87,16.92 v64.01,17.78
  Bottom 0.203: v64.01,17.78 64.26,17.53 64.26,6.6 63.5,5.84 63.5,3.81 BANK1.11
P79  (via drill 0.38)
  Top 0.203: U1.79 65.37,17.69 v64.77,18.29
  Bottom 0.203: BANK1.12 v64.77,18.29
P80  (via drill 0.38)
  Top 0.203: U1.80 65.87,18.2 v65.79,18.29
  Bottom 0.203: v65.79,18.29 65.28,17.78 65.28,10.67 66.8,9.14 66.8,6.6 66.04,5.84 66.04,3.81 BANK1.13
P81  (via drill 0.38)
  Top 0.203: U1.81 66.37,17.09 v66.8,17.53
  Bottom 0.203: v66.8,17.53 65.79,16.51 65.79,10.92 67.31,9.4 BANK1.14
P82  (via drill 0.38)
  Top 0.203: U1.82 66.87,15.05 v66.55,14.73
  Bottom 0.203: BANK1.15 68.58,3.81 68.58,5.59 67.82,6.35 67.82,9.65 66.29,11.18 66.29,14.48 v66.55,14.73
P83  (via drill 0.38)
  Top 0.203: U1.83 67.37,14.03 v67.06,13.72
  Bottom 0.203: BANK1.16 69.85,8.38 66.8,11.43 66.8,13.46 v67.06,13.72
P84  (via drill 0.38)
  Top 0.203: 67.84,17.73 v67.57,18 67.87,17.7 U1.84
  Bottom 0.203: BANK1.17 71.12,3.81 71.12,5.59 70.36,6.35 70.36,8.64 67.82,11.18 67.82,13.97 67.31,14.48 67.31,17.02 67.57,17.28 v67.57,18
P85  (via drill 0.38)
  Top 0.203: v68.07,18.8 68.37,18.5 U1.85
  Bottom 0.203: v68.07,18.8 68.58,18.29 68.58,17.27 67.82,16.51 67.82,14.73 68.33,14.22 68.33,11.43 70.87,8.89 70.87,6.6 BANK1.18
P87  (via drill 0.38)
  Top 0.203: U1.87 69.37,15.21 v69.6,14.99
  Bottom 0.203: BANK1.19 73.66,3.81 73.66,6.86 70.1,10.41 70.1,14.48 v69.6,14.99
P88  (via drill 0.38)
  Top 0.203: U1.88 69.87,16.78 v70.61,17.53
  Bottom 0.203: BANK1.20 74.93,6.35 70.61,10.67 v70.61,17.53
P92
  Top 0.203: U1.92 71.87,13.22 72.9,12.19 72.9,7.62 74.17,6.35 75.44,6.35 76.2,5.59 76.2,3.81 BANK1.21
P93
  Top 0.203: U1.93 72.37,13.48 73.41,12.45 73.41,7.87 74.42,6.86 75.69,6.86 BANK1.22
P94
  Top 0.203: U1.94 72.87,13.74 73.91,12.7 73.91,8.13 74.68,7.37 75.95,7.37 76.96,6.35 77.98,6.35 78.74,5.59 78.74,3.81 BANK1.23
P95
  Top 0.203: U1.95 73.37,14.01 74.42,12.95 74.42,8.38 74.93,7.87 76.2,7.87 77.22,6.86 78.23,6.86 BANK1.24
P97  (via drill 0.38)
  Top 0.203: U1.97 74.37,17.22 v74.17,17.53
  Bottom 0.203: v74.17,17.53 74.42,17.27 74.42,12.45 81.28,5.59 81.28,3.81 BANK1.25
P98  (via drill 0.38)
  Top 0.203: U1.98 74.87,14.79 v75.18,14.48
  Bottom 0.203: v75.18,14.48 75.18,12.45 BANK1.26
P99  (via drill 0.38)
  Top 0.203: U1.99 75.37,17.85 v74.93,18.29
  Bottom 0.203: BANK1.27 83.82,3.81 83.82,5.59 83.06,6.35 82.04,6.35 75.95,12.45 75.95,14.73 74.93,15.75 v74.93,18.29
P100  (via drill 0.38)
  Top 0.203: U1.100 75.87,17.2 v76.2,17.53
  Bottom 0.203: v76.2,17.53 76.45,17.27 76.45,12.7 82.3,6.86 83.31,6.86 BANK1.28
P101
  Top 0.203: U1.101 76.37,12.87 76.2,12.7 76.2,8.64 77.47,7.37 79.5,7.37 81.28,5.59 81.28,4.57 82.04,3.81 86.36,3.81 BANK1.29
P102  (via drill 0.38)
  Top 0.203: U1.102 76.87,18.45 v76.96,18.54
  Bottom 0.203: v76.96,18.54 76.96,12.95 82.55,7.37 85.34,7.37 BANK1.30
P104  (via drill 0.38)
  Top 0.203: U1.104 77.87,14.59 v78.23,14.22
  Bottom 0.203: v78.23,14.22 78.23,12.45 82.8,7.87 86.61,7.87 88.9,5.59 88.9,3.81 BANK1.31
P105  (via drill 0.38)
  Top 0.203: U1.105 78.37,17.39 v78.23,17.53
  Bottom 0.203: v78.23,17.53 78.99,16.76 78.99,12.45 83.06,8.38 86.87,8.38 BANK1.32
P111  (via drill 0.38)
  Top 0.203: U1.111 80.9,18.92 v80.52,19.3
  Bottom 0.203: BANK0.1 93.98,6.35 91.69,6.35 86.87,11.18 86.87,15.24 83.82,18.29 81.53,18.29 v80.52,19.3
P112  (via drill 0.38)
  Top 0.203: U1.112 82.69,19.42 v83.06,19.05
  Bottom 0.203: v83.06,19.05 83.82,19.05 87.38,15.49 87.38,11.94 91.69,7.62 BANK0.2
P114  (via drill 0.38)
  Top 0.203: U1.114 83.47,20.42 v83.57,20.32
  Bottom 0.203: v83.57,20.32 87.88,16 87.88,12.95 91.95,8.89 93.98,8.89 BANK0.3
P115  (via drill 0.38)
  Top 0.203: U1.115 80.36,20.92 v80.26,20.83
  Bottom 0.203: v80.26,20.83 80.52,21.08 83.82,21.08 88.39,16.51 88.39,13.46 91.69,10.16 BANK0.4
P116  (via drill 0.38)
  Top 0.203: U1.116 84.16,21.42 v84.33,21.59
  Bottom 0.203: BANK0.5 93.98,11.43 91.69,11.43 88.9,14.22 88.9,17.02 v84.33,21.59
P117  (via drill 0.38)
  Top 0.203: U1.117 80.7,21.92 v80.26,22.1
  Bottom 0.203: v80.26,22.1 80.52,22.35 84.58,22.35 89.41,17.53 89.41,14.99 91.69,12.7 BANK0.6
P118  (via drill 0.38)
  Top 0.203: U1.118 85.53,22.42 v85.85,22.1
  Bottom 0.203: BANK0.7 93.98,13.97 91.44,13.97 89.92,15.49 89.92,18.29 86.11,22.1 v85.85,22.1
P119  (via drill 0.38)
  Top 0.203: U1.119 80.46,22.92 v80.26,23.11
  Bottom 0.203: v80.26,23.11 80.52,22.86 86.11,22.86 90.42,18.54 90.42,16 91.19,15.24 BANK0.8
P120  (via drill 0.38)
  Top 0.203: U1.120 82.86,23.42 v83.06,23.62
  Bottom 0.203: v83.06,23.62 83.31,23.37 86.36,23.37 90.93,18.8 90.93,17.27 91.69,16.51 93.98,16.51 BANK0.9
P121  (via drill 0.38)
  Top 0.203: U1.121 80.47,23.92 v80.26,24.13
  Bottom 0.203: v80.26,24.13 80.52,24.38 86.11,24.38 BANK0.10
P123  (via drill 0.38)
  Top 0.203: U1.123 79.78,24.92 v79.5,24.64
  Bottom 0.203: v79.5,24.64 79.76,24.89 86.36,24.89 92.2,19.05 93.98,19.05 BANK0.11
P124  (via drill 0.38)
  Top 0.203: U1.124 79.01,25.42 v78.74,25.15
  Bottom 0.203: v78.74,25.15 78.99,25.4 86.61,25.4 91.69,20.32 BANK0.12
P126  (via drill 0.38)
  Top 0.203: U1.126 80.27,26.42 v80.01,26.16
  Bottom 0.203: v80.01,26.16 80.26,25.91 86.87,25.91 91.19,21.59 93.98,21.59 BANK0.13
P127  (via drill 0.38)
  Top 0.203: U1.127 78.99,26.92 v78.74,26.92
  Bottom 0.203: v78.74,26.92 86.61,26.92 90.68,22.86 BANK0.14
P131  (via drill 0.38)
  Top 0.203: U1.131 80.55,28.92 v80.26,29.21
  Bottom 0.203: BANK0.21 93.98,31.75 90.17,31.75 89.66,31.24 85.6,31.24 84.58,30.23 84.58,29.21 84.07,28.7 83.06,28.7 82.55,29.21 v80.26,29.21
P132  (via drill 0.38)
  Top 0.203: U1.132 83.52,29.42 v83.57,29.46
  Bottom 0.203: BANK0.22 90.68,33.02 89.41,31.75 85.34,31.75 83.57,29.97 v83.57,29.46
P133  (via drill 0.38)
  Top 0.203: U1.133 79.7,29.92 v79.5,29.72
  Bottom 0.203: BANK0.23 93.98,34.29 91.19,34.29 89.15,32.26 82.04,32.26 v79.5,29.72
P134  (via drill 0.38)
  Top 0.203: U1.134 79.82,30.42 v79.5,30.73
  Bottom 0.203: BANK0.24 91.69,35.56 88.9,32.77 81.53,32.77 v79.5,30.73
P137
  Top 0.203: U1.137 84.75,31.92 85.85,33.02 89.41,33.02 90.68,34.29 90.68,36.32 91.19,36.83 93.98,36.83 BANK0.25
P138
  Top 0.203: U1.138 84.49,32.42 85.6,33.53 89.15,33.53 90.17,34.54 90.17,36.58 91.69,38.1 BANK0.26
P139
  Top 0.203: U1.139 84.23,32.92 85.34,34.04 88.9,34.04 89.66,34.8 89.66,36.83 92.2,39.37 93.98,39.37 BANK0.27
P140
  Top 0.203: U1.140 83.97,33.42 85.09,34.54 88.65,34.54 89.15,35.05 89.15,37.08 BANK0.28
P141  (via drill 0.38)
  Top 0.203: U1.141 80.91,33.92 v80.26,33.27
  Bottom 0.203: v80.26,33.27 88.65,33.27 91.19,35.81 91.19,41.15 91.95,41.91 93.98,41.91 BANK0.29
P142  (via drill 0.38)
  Top 0.203: U1.142 80.39,34.42 v80.26,34.29
  Bottom 0.203: v80.26,34.29 80.77,33.78 88.39,33.78 90.68,36.07 90.68,42.16 91.69,43.18 BANK0.30
P143  (via drill 0.38)
  Top 0.203: U1.143 82.94,34.92 v83.31,34.54
  Bottom 0.203: v83.31,34.54 88.39,34.54 90.17,36.32 90.17,42.42 92.2,44.45 93.98,44.45 BANK0.31
P144  (via drill 0.38)
  Top 0.203: U1.144 83.17,35.42 v83.31,35.56
  Bottom 0.203: BANK0.32 89.66,42.67 89.66,36.58 88.39,35.31 83.57,35.31 v83.31,35.56
PROGRAM_B  (via drill 0.38)
  Top 0.203: U1.37 58.81,35.42 56.39,37.85 R17.2 55.46,39.97 v55.88,40.39 | v52.58,43.69 51.05,42.16 51.05,34.04 45.72,28.7 43.18,28.7 42.16,29.72 v39.37,29.72 | U2.24 v28.96,23.62
  Bottom 0.203: v52.58,43.69 52.58,42.93 55.12,40.39 v55.88,40.39 | v28.96,23.62 28.96,27.18 31.5,29.72 v39.37,29.72
TCK/CCLK  (via drill 0.38)
  Top 0.203: JTAG/SPI-FLASH.6 49.53,3.81 49.53,13.72 48.64,14.61 v47.5,14.61 | U1.70 61.85,18.92 v62.23,19.3 | U1.109 80.91,17.92 v80.77,17.78 | v47.49,14.61 U3.6 | v47.5,14.61 R11.1 | v47.5,14.61 v47.49,14.61 | v47.49,14.61 47.5,14.6 | v47.5,14.61 R12.2 | v47.5,14.61 | U2.16 v23.61,22.11 v23.62,22.1
  Top 0.254: U1.109 84.95,17.92 85.85,17.02 R5.1
  Bottom 0.203: v80.77,17.78 80.52,17.78 79.76,18.54 79.76,19.56 79.25,20.07 62.99,20.07 v62.23,19.3 62.23,17.78 59.05,14.61 v47.5,14.61 | JTAG/SPI-FLASH.6 46.48,4.32 42.93,4.32 42.16,5.08 42.16,18.29 37.59,22.86 28.19,22.86 26.67,24.38 24.38,24.38 23.62,23.62 v23.62,22.1
TDI/MOSI  (via drill 0.38)
  Top 0.203: v58.93,21.59 59.26,21.92 U1.64 77.65,21.92 79.76,19.81 79.76,19.05 80.39,18.42 U1.110 | JTAG/SPI-FLASH.3 44.89,6.79 v44.89,12.19 U3.5 | U2.17 25.46,20.01 v25.65,19.81 | v58.42,13.21 v58.42,16.76
  Top 0.254: U1.110 84.97,18.42 85.87,19.32 R4.1
  Bottom 0.203: v25.65,19.81 27.18,21.34 36.83,21.34 40.64,17.53 JTAG/SPI-FLASH.3 | v58.93,21.59 58.42,21.08 v58.42,16.76 | v58.42,13.21 58.17,13.46 46.16,13.46 v44.89,12.19
TDO/DIN  (via drill 0.38)
  Top 0.203: U3.2 36.45,15.88 35.81,15.24 35.81,12.45 37.34,10.92 37.34,6.1 39.37,4.06 39.37,1.78 40.13,1.02 42.67,1.02 43.18,1.52 JTAG/SPI-FLASH.4 43.18,4.32 45.72,6.86 v45.72,11.94 | U1.65 61.89,21.42 v62.23,21.08 76.2,21.08 78.87,18.41 U1.106 | U2.18 25.96,23.42 v26.16,23.62 | v59.18,17.53 57.4,17.53 56.64,16.76 v56.64,12.7
  Bottom 0.203: v26.16,23.62 26.16,22.61 26.92,21.84 37.08,21.84 41.15,17.78 41.15,4.57 JTAG/SPI-FLASH.4 | v56.64,12.7 46.48,12.7 v45.72,11.94 | v62.23,21.08 61.47,20.32 61.47,18.03 60.96,17.53 v59.18,17.53
TMS  (via drill 0.38)
  Top 0.203: v42.93,13.97 40.64,11.68 v38.61,11.68 | v78.99,19.3 79.37,18.92 79.37,15.24
  Top 0.254: U1.107 79.37,15.24 79.37,11.18 R6.1
  Bottom 0.203: v42.93,13.97 59.18,13.97 64.77,19.56 78.74,19.56 v78.99,19.3 | SELECT.1 31.75,8.64 34.8,11.68 v38.61,11.68
TMS/CSO_B  (via drill 0.38)
  Top 0.203: U2.19 26.46,22.4 v26.92,22.86
  Bottom 0.203: SELECT.2 30.73,1.02 44.2,1.02 JTAG/SPI-FLASH.5 44.45,3.81 42.67,3.81 41.66,4.83 41.66,18.03 37.34,22.35 27.43,22.35 v26.92,22.86
VCCO_0  (via drill 0.38)
  Top 0.254: U1.122 84.8,24.42 85.5,23.72 C19.1 | U1.125 86.74,25.92 C20.1 | C21.1 85.94,31.58 85.28,30.92 U1.135 80.59,30.92 79.5,32 79.5,35.56 84.58,40.64 VCCO_0.2
  Top 0.381: v96.52,48.01 93.22,48.01 91.19,45.97 91.19,42.16 89.66,40.64 VCCO_0.2 | C19.1 86.78,24.89 | 86.78,24.89 C20.1 | 86.78,24.89 v89.92,24.89
  Bottom 0.381: v96.52,48.01 97.28,47.24 97.28,24.64 96.77,24.13 90.68,24.13 v89.92,24.89 92.71,27.69 BANK0.18
VCCO_1  (via drill 0.38)
  Top 0.254: 63.87,11.12 U1.76 | C17.1 66.94,12.08 68.87,14.01 U1.86 68.87,19.85 69.6,20.57 75.95,20.57 77.72,18.8 77.72,18.29 77.37,17.93 U1.103 77.37,11.14 C18.1
  Top 0.305: 66.83,11.12 C17.1
  Top 0.381: BANK1.6 VCCO_1.2 | 66.83,11.12 63.87,11.12 C16.1 62.83,11.01 v62.74,10.92
  Bottom 0.381: VCCO_1.2 58.42,11.43 62.23,11.43 v62.74,10.92
VCCO_3  (via drill 0.38)
  Top 0.254: C11.1 78.68,40.83 78.37,40.52 U1.4 78.37,36.69 78.99,36.07 78.99,34.04 78.49,33.53 71.63,33.53 71.12,34.04 71.12,35.81 71.37,36.06 U1.18 71.37,39.11 73.75,41.49 C12.1 | U1.31 64.87,42.28 C13.1
  Top 0.381: BANK3.3 54.61,45.72 VCCO_3.2 | v58.42,45.97 v63.5,45.97 67.31,45.97 68.07,46.74 70.87,46.74 71.63,45.97 74.17,45.97 74.93,45.21 74.93,42.67 74.59,42.33 C12.1 | C13.1 63.6,42.33 v63.57,42.3
  Bottom 0.381: v58.42,45.97 58.42,44.45 VCCO_3.2 | v63.5,45.97 63.5,42.37 v63.57,42.3

## Text on the board
tNames: 96 | 90 | 80 | 70 | 66 | 95 | 89 | 79 | 69 | 65 | 63 | 64 | +3V3 | +1V2 | 59 | +3V3 | AIN | +1V2 | GND | dangerousprototypes.com | 49 | 50 | 39 | 40 | +3V3 | +1V2 | 2 | 10 | 20 | 30 | 34 | 33 | 32 | SPI | JTAG | +3V3 | GND | TDI/MOSI | TDO/MISO | TMS/CS | TCK/SCK | 1 | 9 | 19 | 29 | 31
bNames: 96 | 90 | 80 | 70 | 66 | 95 | 89 | 79 | 69 | 65 | BANK3 | 64 | 63 | 60 | 59 | BANK1 | BANK0 | BANK3 | +5V | +5V | P1 | P2 | 1 | 2 | 33 | P111 | P112 | 34 | 65 | 66 | GND | +3V3 | P5 | P6 | GND | VCCO_1 | P114 | P115 | P7 | P8 | P116 | P117 | 69 | 70 | GND | +1V2 | P9 | P10 | P74 | P75 | 39 | P118 | P119 | 40 | 9 | 10 | P120 | P121 | P11 | P12 | P78 | P79 | P14 | P15 | BANK0 | 50 | P80 | P81 | P123 | P124 | P126 | P127 | P16 | P17 | 49 | P82 | P83 | P21 | P22 | P84 | P85 | GND | +1V2 | 79 | 80 | 49 | GND | VCCO_0 | 50 | P23 | P24 | P87 | P88 | P26 | P27 | 19 | P92 | P93 | 20 | GND | +3V3 | P131 | P132 | P29 | P30 | P94 | P95 | P32 | P33 | P97 | P98 | P133 | P134 | P137 | P138 | 89 | P34 | P35 | 90 | P99 | P100 | +1V2 | GND | 59 | P139 | P140 | 60 | 40 | P101 | P102 | VCCO_3 | GND | 29 | P104 | P105 | 30 | P141 | P142 | +3V3 | +5V | 39 | 31 | 32 | 63 | P143 | P144 | 64 | 95 | 96 | 34 | BANK1 | 33 | 2 | 10 | 20 | 30 | 32 | 1 | 9 | 19 | 29 | 31